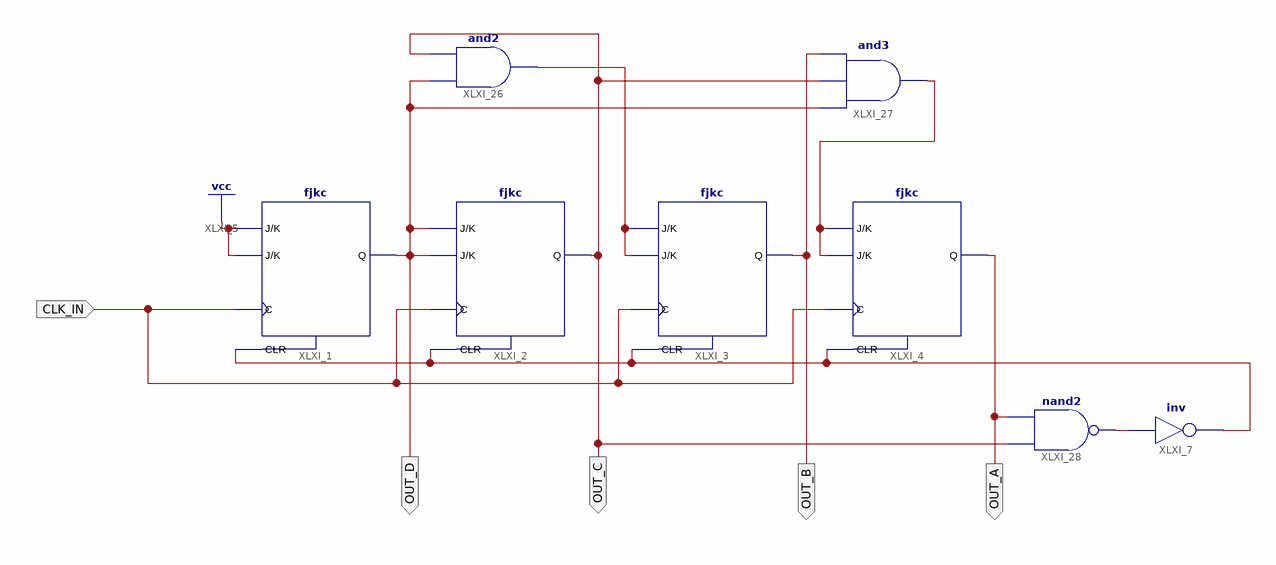
[diagram p0: schematic sheet 1]
// Xilinx ISE schematic Count10.sch (spartan6) as structural Verilog: 8 symbols, 5 ports
module Count10 (
  input  CLK_IN,
  output OUT_D,
  output OUT_B,
  output OUT_C,
  output OUT_A
);

  wire CLK_OUT, XLXN_4, XLXN_5, XLXN_12;

  fjkc XLXI_1 (.C(CLK_IN), .CLR(CLK_OUT), .J(1'b1), .K(1'b1), .Q(OUT_D));
  fjkc XLXI_3 (.C(CLK_IN), .CLR(CLK_OUT), .J(XLXN_4), .K(XLXN_4), .Q(OUT_B));
  fjkc XLXI_2 (.C(CLK_IN), .CLR(CLK_OUT), .J(OUT_D), .K(OUT_D), .Q(OUT_C));
  fjkc XLXI_4 (.C(CLK_IN), .CLR(CLK_OUT), .J(XLXN_5), .K(XLXN_5), .Q(OUT_A));
  not XLXI_7 (CLK_OUT, XLXN_12);
  and XLXI_26 (XLXN_4, OUT_D, OUT_C);
  and XLXI_27 (XLXN_5, OUT_D, OUT_C, OUT_B);
  nand XLXI_28 (XLXN_12, OUT_C, OUT_A);
endmodule
